# Altium project amt203s_connector.PrjPcb
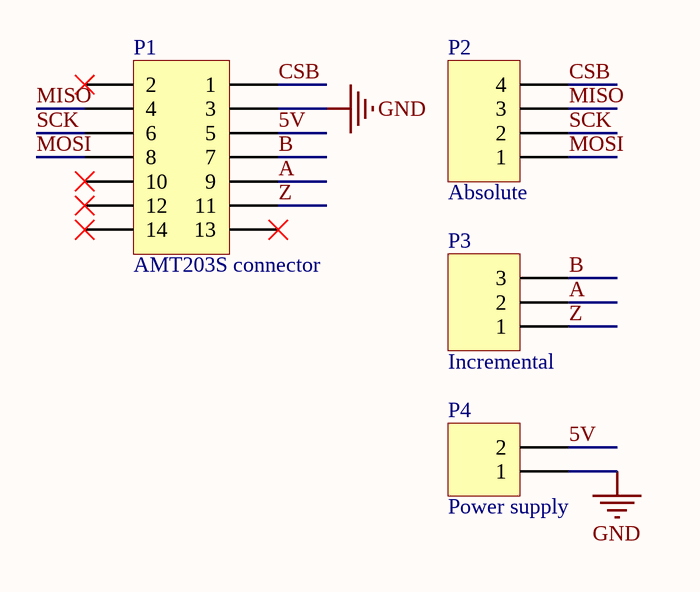
[diagram p0: amt203s_connector.schdoc]
1 sheet, 4 parts. Net scope: global (net labels, ports and power ports of the same name join across sheets).
Board file: amt203s_connector.PCBDOC

## Sheet amt203s_connector.schdoc: AT long bus (13.3 x 4.2 inches)
size A; Organization: Organization; Address1: Address1; Address2: Address2; Address3: Address3; Address4: Address4; DocumentNumber: 1; Revision: 0; SheetNumber: 2; SheetTotal: 2

### Parts
P1  AMT203S connector  [HDR2X7_1.27mm-AMT203_connector]
P2  Absolute  [HDR1X4]
P3  Incremental  [HDR1X3]
P4  Power supply  [HDR1X2]

### Nets
GND: P1.3 P4.1
5V: P1.5 P4.2
A: P1.9 P3.2
B: P1.7 P3.3
CSB: P1.1 P2.4
MISO: P1.4 P2.3
MOSI: P1.8 P2.1
SCK: P1.6 P2.2
Z: P1.11 P3.1

Not connected (* = marked no-connect by the designer): P1 2* 10* 12* 13* 14*

### Library data of the parts
P1 = Header 7X2: Header, 7-Pin, Dual row; LatestRevisionDate: 17-Jul-2002; LatestRevisionNote: Re-released for DXP Platform.; Publisher: Altium Limited
P2 = Header 4: Header, 4-Pin; LatestRevisionDate: 17-Jul-2002; LatestRevisionNote: Re-released for DXP Platform.; Publisher: Altium Limited
P3 = Header 3: Header, 3-Pin; LatestRevisionDate: 17-Jul-2002; LatestRevisionNote: Re-released for DXP Platform.; Publisher: Altium Limited
P4 = Header 2: Header, 2-Pin; LatestRevisionDate: 17-Jul-2002; LatestRevisionNote: Re-released for DXP Platform.; Publisher: Altium Limited